# Altium schematic sheet Power.SchDoc
size A4; Organization: ORGANIZATION; Address1: ADDRESS 1; Address2: ADDRESS 2; Address3: ADDRESS 3; Address4: ADDRESS 4; Revision: -; SheetNumber: 2; SheetTotal: 10; ENG_APP_DATE: --/--/--; DSN_APP_DATE: --/--/--; CHK_APP_DATE: --/--/--
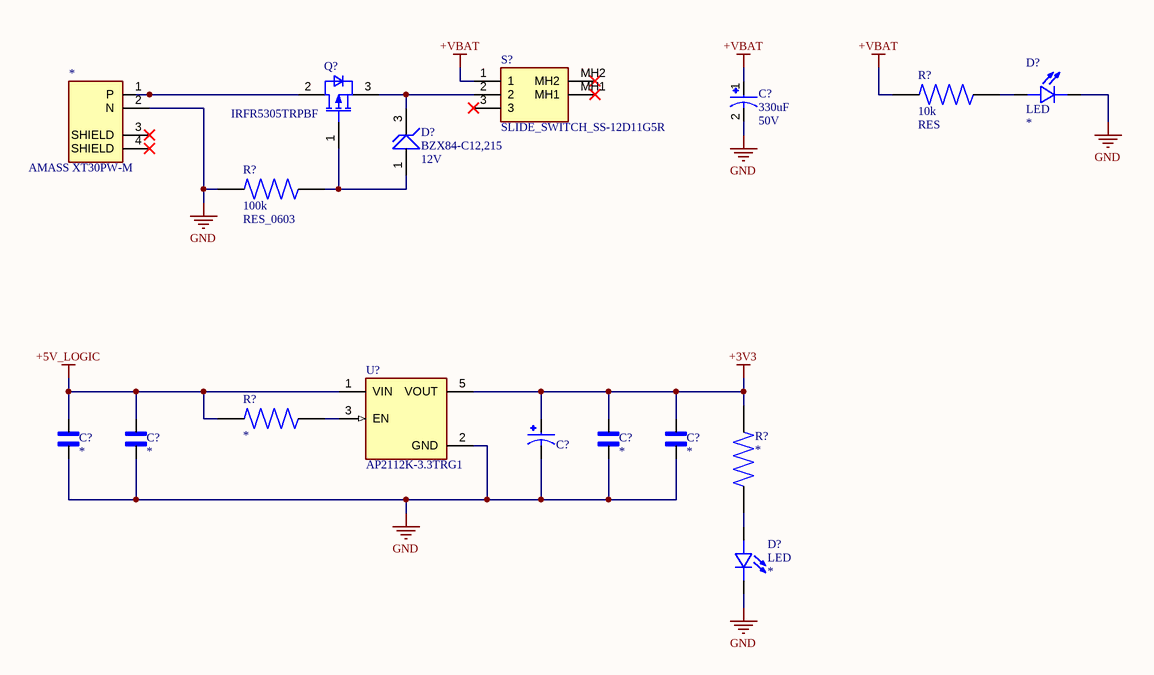
[diagram p0: Power.SchDoc]

## Parts
(Parts that share a designator on the sheet are numbered #1, #2 ... from top to bottom, then left to right.)
*  AMASS XT30PW-M  [AMASS_XT30PW-M]
C?#1  value 330uF  Voltage Rating: 50V  [P_CAP_10X10.2]  (hidden comment: P_CAP)
C?#2  P_CAP  [P_CAP_6.3x5.8]  (value not drawn)
C?#3  N_P_CAP  [N_P_CAP_0402]  (value not drawn)
C?#4  N_P_CAP  [N_P_CAP_0402]  (value not drawn)
C?#5  N_P_CAP  [N_P_CAP_0402]  (value not drawn)
C?#6  N_P_CAP  [N_P_CAP_0402]  (value not drawn)
D?#1  LED  [LED_0603]
D?#2  BZX84-C12,215  Zener Voltage: 12V  [SOT-23]
D?#3  LED  [LED_0603]
Q?  IRFR5305TRPBF  [PG-TO252-3]
R?#1  RES  value 10k  [RES_0603]
R?#2  RES_0603  value 100k  [RES_0603]
R?#3  RES  [RES_0603]  (value not drawn)
R?#4  RES  [RES_0603]  (value not drawn)
S?  SLIDE_SWITCH_SS-12D11G5R  [SLIDE_SWITCH_SS-12D11G5R]
U?  AP2112K-3.3TRG1  [SOT95P285X140-5N]

## Nets
+3V3: C?#2.1 C?#5.2 C?#6.2 R?#4.1 U?.5(VOUT)
+5V_LOGIC: C?#3.2 C?#4.2 R?#3.1 U?.1(VIN)
+VBAT: C?#1.1 R?#1.2 S?.1
GND: *.2(N) C?#1.2 C?#2.2 C?#3.1 C?#4.1 C?#5.1 C?#6.1 D?#1.1(C) D?#3.1(C) R?#2.2 U?.2(GND)
Net*_1: *.1(P) Q?.2(DRAIN)
NetD?#1_2: D?#1.2(A) R?#1.1
NetD?#2_1: D?#2.1(A) Q?.1(GATE) R?#2.1
NetD?#2_3: D?#2.3(C) Q?.3(SOURCE) S?.2
NetD?#3_2: D?#3.2(A) R?#4.2
NetR?#3_2: R?#3.2 U?.3(EN)

Not connected (* = marked no-connect by the designer): * 3(SHIELD)* 4(SHIELD)*; S? 3* MH1* MH2*

## Notes on the sheet
- DWG. NO.
- REV.
- SHT.
- THIS DOCUMENT AND THE DATA DISCLOSED HEREIN OR HEREWITH IS THE PROPERTY OF ALTIUM LIMITED AND MAY BE FREELY DISTRIBUTED IN WHOLE. NO RIGHTS ARE RESERVED OR EXPRESS OR IMPLIED WARANTEE GIVEN.
- REVISION
- DESCRIPTION
- DATE
- APPROVED
- ENG:
- APPROVALS
- PROJECT
- DSN:
- CHK:
- REFERENCE DOCUMENTS
- PROJECT REVISION:
- TITLE
- DOCUMENT REVISION:
- DESIGN ITEM:
- BOM:
- FAB DWG:
- PCB DWG:
- ASSY DWG:
- SCALE:
- SIZE
- B
- CAGE CODE
- FILE NAME
- DWG NO.
- SHEET
- OF
- REV

## Library data of the parts
* = AMASS_PCB_CONNECTOR: GENERIC AMASS PCB CONNECTOR; MF: Amass; LCSC Part Number: *
C?#1 = P_CAP: GENERIC POLARIZED CAP; MPN: EEEFT1H331AP; MF: PANASONIC; LCSC Part Number: C178596; Tolerance: *; Package: SMD,D10xL10.2mm; ESR: *
C?#2 = P_CAP: GENERIC POLARIZED CAP; MF: Panasonic; MP: EEE-FT1V101AP; SnapEDA_Link: https://www.snapeda.com/parts/EEE-FT1V101AP/Panasonic+Electronic+Components/view-part/?ref=snap; Package: RADIAL-2 Panasonic; Value: *; Check_prices: https://www.snapeda.com/parts/EEE-FT1V101AP/Panasonic+Electronic+Components/view-part/?ref=eda
C?#3-C?#6 = N_P_CAP: GENERIC NON-POLARIZED CAP; Package: *; Value: *
D?#1 D?#3 = LED: GENERIC LED; MPN: *; Forward Voltage: *; Package: *; Color: *
  D?#1: LCSC Part Number: *; Forward Current: *
D?#2 = ZENER_DIODE: GENERIC ZENER DIODE; Power Dissipation: 250mW; LCSC Part Number: C108437
Q? = MOSFET_P_CHANNEL: GENERIC MOSFET P CHANNEL; Type: P-Channel; LCSC Part Number: *; Drain to Source Voltage: *; Current - Continuous Drain: *; Gate Threshold Voltage: *
R?#1 = RES: GENERIC RES; MPN: RC0603FR-0710KL; Power Rating: 100mW; Tolerance: 1%; Voltage Rating: 75V; Temperature Coefficient: *; Package: 0603; LCSC Part Number: C98220
R?#2 = RES: GENERIC RES; MPN: RC0603FR-07100KL; Power Rating: 75V; Tolerance: 1%; Voltage Rating: 75V; Temperature Coefficient: *; Package: 0603; LCSC Part Number: C14675
R?#3 = RES: GENERIC RES; Power Rating: *; Tolerance: *; MPN: *; Voltage Rating: *; Temperature Coefficient: *; Package: *; Value: *; LCSC Part Number: *
S? = SLIDE_SWITCH_SS-12D11G5R: SLIDE SWITCH SS-12D11G5R; Manufacturer Name: XKB Connectivity; Height: 6.9mm; Manufacturer Part Number: SS-12D11G5R; LCSC Part Number: C388633
U? = AP2112K-3.3TRG1: Linear Voltage Regulator IC Positive Fixed 1 Output 600mA SOT-25; MF: Diodes Inc.; Value: *; Purchase-URL: https://pricing.snapeda.com/search/part/AP2112K-3.3TRG1/?ref=eda; Package: SOT-753 Diodes Inc.; Availability: In Stock; Check_prices: https://www.snapeda.com/parts/AP2112K-3.3TRG1/Diodes+Inc./view-part/?ref=eda; Price: None; SnapEDA_Link: https://www.snapeda.com/parts/AP2112K-3.3TRG1/Diodes+Inc./view-part/?ref=snap; MP: AP2112K-3.3TRG1
R?#4 = RES: Power Rating: *; Tolerance: *; MPN: *; Voltage Rating: *; Temperature Coefficient: *; Package: *; Value: *